# EAGLE design tag-connect-tc2030_v1 (EAGLE 8.7.0)
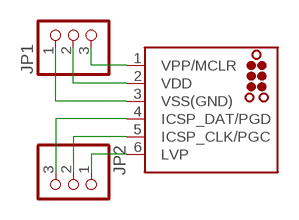
[diagram p0: schematic, sheet 1]

## Parts
JP1  PINHD-1X3  [1X03]
JP2  PINHD-1X3  [1X03]
TAG-CONN  TC2030-MCP  [TC2030-MCP]

## Nets
ICSP_CLK/PGC: JP2.2 TAG-CONN.5(ICSP_CLK/PGC)
ICSP_DAT/PGD: JP2.3 TAG-CONN.4(ICSP_DAT/PGD)
LVP: JP2.1 TAG-CONN.6(LVP)
VDD: JP1.2 TAG-CONN.2(VDD)
VPP/MCLR: JP1.3 TAG-CONN.1(VPP/MCLR)
VSS(GND): JP1.1 TAG-CONN.3(VSS(GND))

## Library data of the parts
JP1 JP2 = pinhead:PINHD-1X3: PIN HEADER
TAG-CONN = tag-connect:TC2030: TAG-CONNECT ICSP Connector Manufacturer: Tag-Connect <http://www.tag-connect.com> Cable for easy In-Circuit Serial Programming. Designed for Microchip ICD2, suitable for many others. Two variants - one "with legs" (for hands-free fit on PCB) and another "without legs" for quick programming. PAD Description 1 MCLR/Vpp 2 Vdd 3 GND 4 PGD (ISPDAT) 5 PGC (ISPCLK) 6 nc (used for LVP) ©2009 ROFA.cz - modified and updated by Robert Darlington ‹rdarlington@gmail.com›

## Board
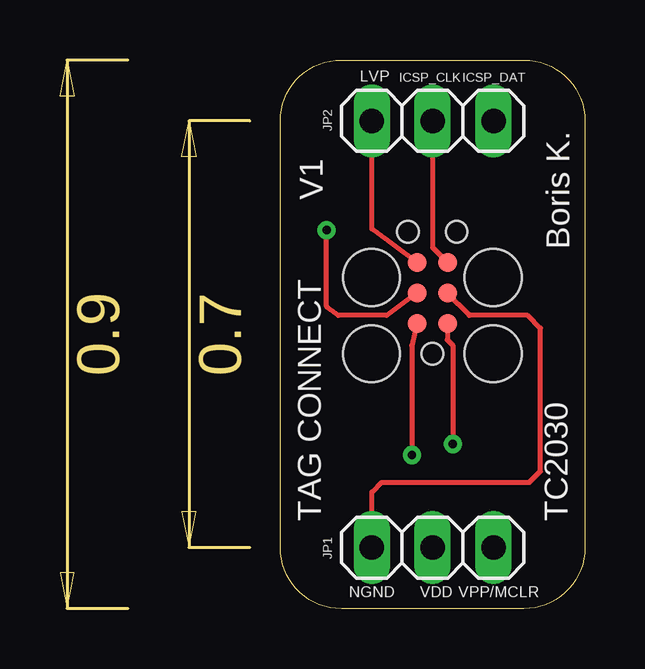
[diagram p1: board, top side]
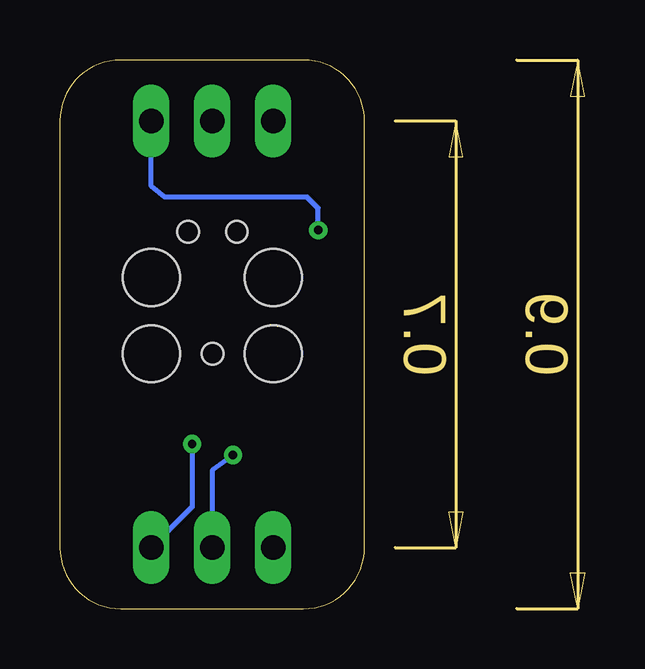
[diagram p2: board, bottom side, seen from below]

Size 12.7 x 22.86 mm. Coordinates in mm from the lower left corner, seen from the top.
Outline: 2.54,0 arc-90 0,2.54 0,20.32 arc-90 2.54,22.86 10.16,22.86 arc-90 12.7,20.32 12.7,2.54 arc-90 10.16,0 2.54,0
Copper layers (1*16): Top 0.035mm / dielectric 1.5mm / Bottom 0.035mm
Design rules "default *": minimum track width 6mil, minimum drill 0.35mm, track to track 6mil, track to pad 6mil, pad to pad 6mil, via to via 6mil, smd to smd 6mil, copper to edge 6mil, drill to drill 6mil, minimum pad ring 10mil, minimum via ring 8mil, stop-mask expansion 4mil, vias tented up to drill 0mil, thermal gap 10mil

### Footprints (pad centres in the part's own frame; a part is rotated, then mirrored left to right if it is on the bottom)
1X03 = drill 1.016 long: 1 -2.54,0; 2 0,0; 3 2.54,0
TC2030-MCP = smd 0.787 x 0.787: 1 1.27,-0.635; 2 1.27,0.635; 3 2.54,-0.635; 4 2.54,0.635; 5 3.81,-0.635; 6 3.81,0.635 | hole 0.889: 0,0; 5.08,-1.016; 5.08,1.016 | hole 2.375: 0,2.54; 0,-2.54; 3.175,-2.54; 3.175,2.54

### Placement (x,y rotation side)
JP1  6.35,2.54 0 top
JP2  6.35,20.32 0 top
TAG-CONN  6.34,10.62 90 top

### Tracks (layer width: path | path; a pad name or v marks a point on that pad's centre or on a via)
ICSP_CLK/PGC
  Top 0.2: JP2.2 6.35,15.05 TAG-CONN.5
ICSP_DAT/PGD  (via drill 0.35)
  Top 0.2: TAG-CONN.4 4.45,12.22 2.41,12.22 1.93,12.57 v1.93,15.77
  Bottom 0.2: v1.93,15.77 1.93,16.69 2.39,17.14 8.33,17.14 8.89,17.6 JP2.3
LVP
  Top 0.2: TAG-CONN.6 3.81,15.82 JP2.1
VDD  (via drill 0.35)
  Top 0.2: TAG-CONN.2 5.49,10.97 v5.49,6.4
  Bottom 0.2: v5.49,6.4 6.35,5.77 JP1.2
VPP/MCLR  (via drill 0.35)
  Top 0.2: TAG-CONN.1 6.96,11.88 6.96,11.2 7.19,10.97 v7.19,6.86
  Bottom 0.2: v7.19,6.86 7.19,4.24 JP1.3
VSS(GND)
  Top 0.2: JP1.1 3.81,4.85 4.22,5.26 10.39,5.26 10.85,5.71 10.85,11.68 10.31,12.22 7.87,12.22 6.97,13.12 TAG-CONN.3 7.06,13.16

### Text on the board
tPlace: LVP | ICSP_CLK | ICSP_DAT | Boris K. | V1 | TAG CONNECT | TC2030 | NGND | VDD | VPP/MCLR